# Altium schematic sheet Sheet_2.schdoc
size 424 x 282 mm
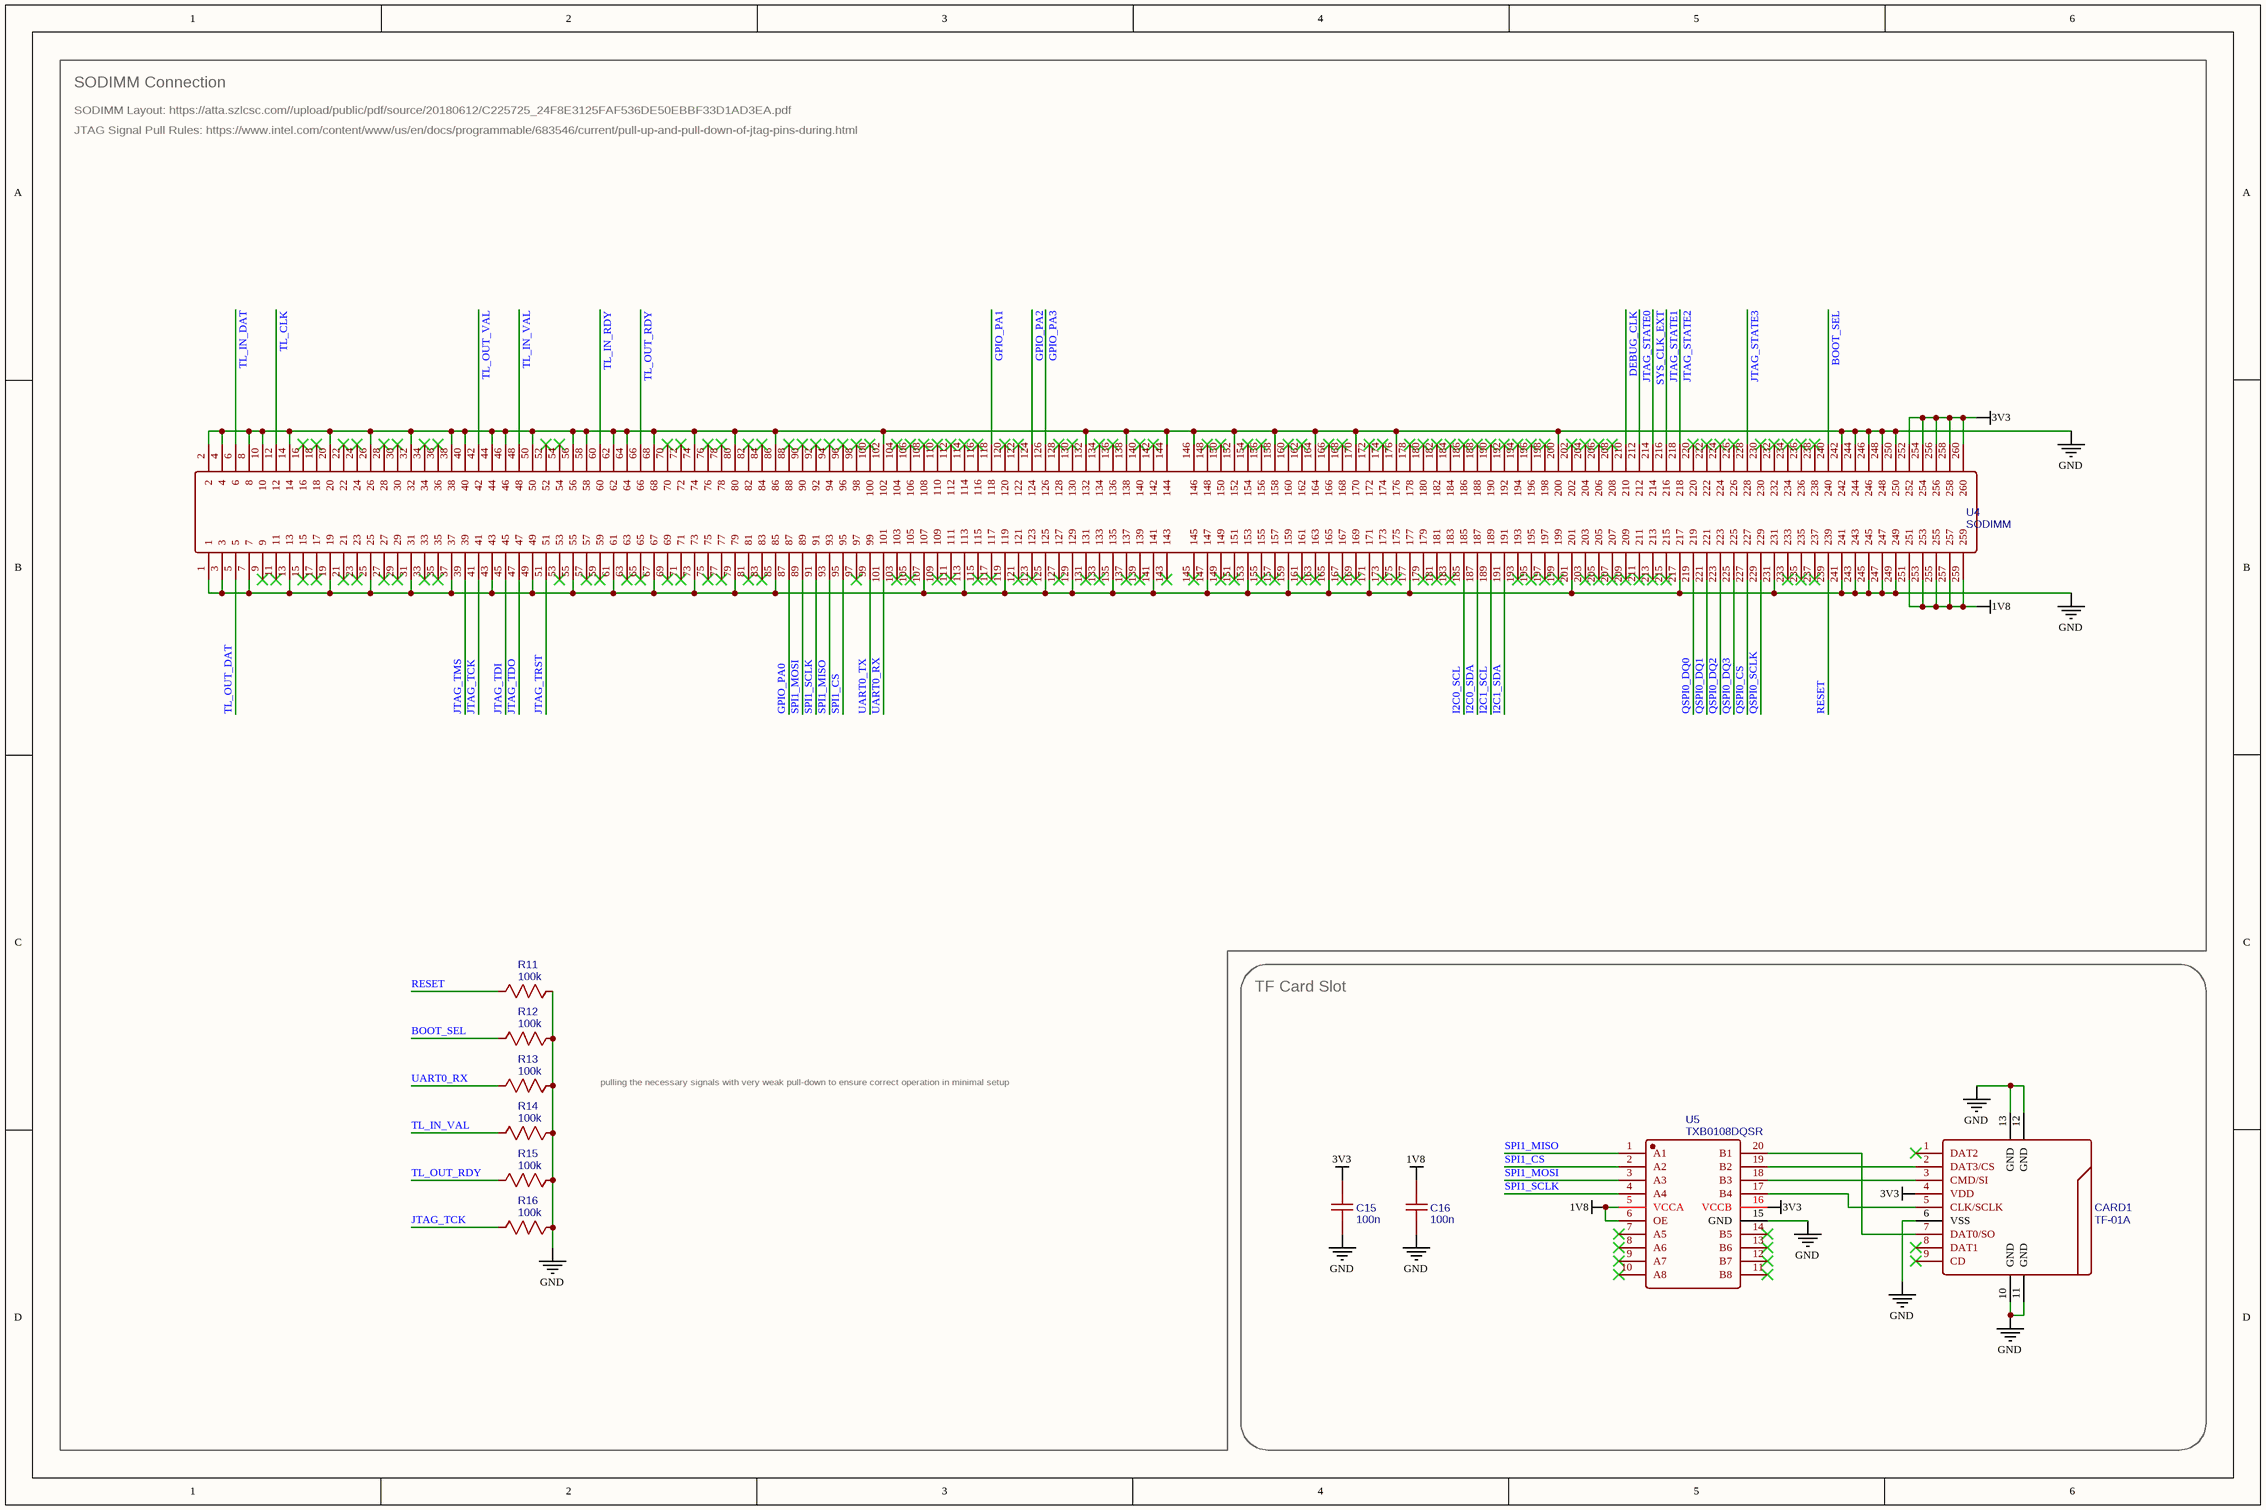
[diagram p0: Sheet_2.schdoc]

## Parts
C15  100n  [CAPA-0402]
C16  100n  [CAPA-0402]
CARD1  TF-01A  [TF-SMD_TF-01A]
R11  100k  [RES-0402]
R12  100k  [RES-0402]
R13  100k  [RES-0402]
R14  100k  [RES-0402]
R15  100k  [RES-0402]
R16  100k  [RES-0402]
U4  SODIMM  [SODIMM 260]
U5  TXB0108DQSR  [SON-20_L4.0-W2.0-P0.40-BL]

## Blocks framed on the sheet
SODIMM Connection: R11-R16 U4
TF Card Slot: C15 C16 CARD1 U5

## Nets
1V8: C16.2 U4.251 U4.253 U4.255 U4.257 U4.259 U5.5(VCCA) U5.6(OE)
3V3: C15.2 CARD1.4(VDD) U4.252 U4.254 U4.256 U4.258 U4.260 U5.16(VCCB)
GND: C15.1 C16.1 CARD1.6(VSS) CARD1.10(GND) CARD1.11(GND) CARD1.12(GND) CARD1.13(GND) R11.2 R12.2 R13.2 R14.2 R15.2 R16.2 U4.1 U4.2 U4.3 U4.4 U4.7 U4.8 U4.10 U4.13 U4.14 U4.19 U4.20 U4.25 U4.26 U4.31 U4.32 U4.37 U4.38 U4.40 U4.43 U4.44 U4.46 U4.49 U4.50 U4.55 U4.56 U4.58 U4.61 U4.62 U4.64 U4.67 U4.68 U4.73 U4.74 U4.79 U4.80 U4.85 U4.86 U4.102 U4.107 U4.113 U4.119 U4.125 U4.129 U4.132 U4.135 U4.138 U4.141 U4.144 U4.146 U4.147 U4.152 U4.153 U4.158 U4.159 U4.164 U4.165 U4.170 U4.171 U4.176 U4.177 U4.200 U4.201 U4.217 U4.231 U4.241 U4.242 U4.243 U4.244 U4.245 U4.246 U4.247 U4.248 U4.249 U4.250 U5.15(GND)
BOOT_SEL: R12.1 U4.240
DEBUG_CLK: U4.210
GPIO_PA0: U4.87
GPIO_PA1: U4.118
GPIO_PA2: U4.124
GPIO_PA3: U4.126
I2C0_SCL: U4.185
I2C0_SDA: U4.187
I2C1_SCL: U4.189
I2C1_SDA: U4.191
JTAG_STATE0: U4.212
JTAG_STATE1: U4.216
JTAG_STATE2: U4.218
JTAG_STATE3: U4.228
JTAG_TCK: R16.1 U4.41
JTAG_TDI: U4.45
JTAG_TDO: U4.47
JTAG_TMS: U4.39
JTAG_TRST: U4.51
QSPI0_CS: U4.227
QSPI0_DQ0: U4.219
QSPI0_DQ1: U4.221
QSPI0_DQ2: U4.223
QSPI0_DQ3: U4.225
QSPI0_SCLK: U4.229
RESET: R11.1 U4.239
SPI1_CS: U4.95 U5.2(A2)
SPI1_MISO: U4.93 U5.1(A1)
SPI1_MOSI: U4.89 U5.3(A3)
SPI1_SCLK: U4.91 U5.4(A4)
SYS_CLK_EXT: U4.214
TL_CLK: U4.12
TL_IN_DAT: U4.6
TL_IN_RDY: U4.60
TL_IN_VAL: R14.1 U4.48
TL_OUT_DAT: U4.5
TL_OUT_RDY: R15.1 U4.66
TL_OUT_VAL: U4.42
UART0_RX: R13.1 U4.101
UART0_TX: U4.99
NetCARD1_2: CARD1.2(DAT3/CS) U5.19(B2)
NetCARD1_3: CARD1.3(CMD/SI) U5.18(B3)
NetCARD1_5: CARD1.5(CLK/SCLK) U5.17(B4)
NetCARD1_7: CARD1.7(DAT0/SO) U5.20(B1)

Not connected (* = marked no-connect by the designer): CARD1 1(DAT2)* 8(DAT1)* 9(CD)*; U4 9* 11* 15* 16* 17* 18* 21* 22* 23* 24* 27* 28* 29* 30* 33* 34* 35* 36* 52* 53* 54* 57* 59* 63* 65* 69* 70* 71* 72* 75* 76* 77* 78* 81* 82* 83* 84* 88* 90* 92* 94* 96* 97* 98* 100* 103* 104* 105* 106* 108* 109* 110* 111* 112* 114* 115* 116* 117* 120* 121* 122* 123* 127* 128* 130* 131* 133* 134* 136* 137* 139* 140* 142* 143* 145* 148* 149* 150* 151* 154* 155* 156* 157* 160* 161* 162* 163* 166* 167* 168* 169* 172* 173* 174* 175* 178* 179* 180* 181* 182* 183* 184* 186* 188* 190* 192* 193* 194* 195* 196* 197* 198* 199* 202* 203* 204* 205* 206* 207* 208* 209* 211* 213* 215* 220* 222* 224* 226* 230* 232* 233* 234* 235* 236* 237* 238*; U5 7(A5)* 8(A6)* 9(A7)* 10(A8)* 11(B8)* 12(B7)* 13(B6)* 14(B5)*

## Notes on the sheet
- SODIMM Layout: https://atta.szlcsc.com//upload/public/pdf/source/20180612/C225725_24F8E3125FAF536DE50EBBF33D1AD3EA.pdf
- JTAG Signal Pull Rules: https://www.intel.com/content/www/us/en/docs/programmable/683546/current/pull-up-and-pull-down-of-jtag-pins-during.html
- pulling the necessary signals with very weak pull-down to ensure correct operation in minimal setup

## Library data of the parts
C15 C16 = 100n: BOM_Manufacturer Part: CL05B104KB54PNC; BOM_Manufacturer: SAMSUNG; nameAlias: Value(F); BOM_Supplier Part: C307331; BOM_Supplier: LCSC; link: https://atta.szlcsc.com//upload/public/pdf/source/20160103/1457707735223.pdf; spicePre: C; spiceSymbolName: CAPA-0402_100n
CARD1 = TF-01A: BOM_Manufacturer: 韩国韩荣; BOM_Supplier: LCSC; BOM_Manufacturer Part: TF-01A; BOM_Supplier Part: C91145; BOM_JLCPCB Part Class: Extended Part; spicePre: C; spiceSymbolName: TF-01A
R11-R16 = 100k: BOM_Manufacturer Part: 0402WGF1003TCE; BOM_Manufacturer: UniOhm 台湾厚声; nameAlias: Value(Ω); BOM_Supplier Part: C25741; BOM_Supplier: LCSC; link: https://atta.szlcsc.com//upload/public/pdf/source/20200306/C422600_1E6D84923E4A46A82E41ADD87F860B5C.pdf; spicePre: R; spiceSymbolName: RES-0402_100k
U4 = SODIMM: Contributor: t-k-233; spicePre: U; spiceSymbolName: SODIMM
U5 = TXB0108DQSR: BOM_Manufacturer: TI; BOM_Supplier: LCSC; BOM_Manufacturer Part: TXB0108DQSR; BOM_Supplier Part: C427057; BOM_JLCPCB Part Class: Extended Part; link: https://www.ti.com/lit/ds/symlink/txb0108.pdf?HQS=dis-mous-null-mousermode-dsf-pf-null-wwe; spicePre: U; spiceSymbolName: TXB0108DQSR